# EAGLE design sensor_board (EAGLE 9.6.2)
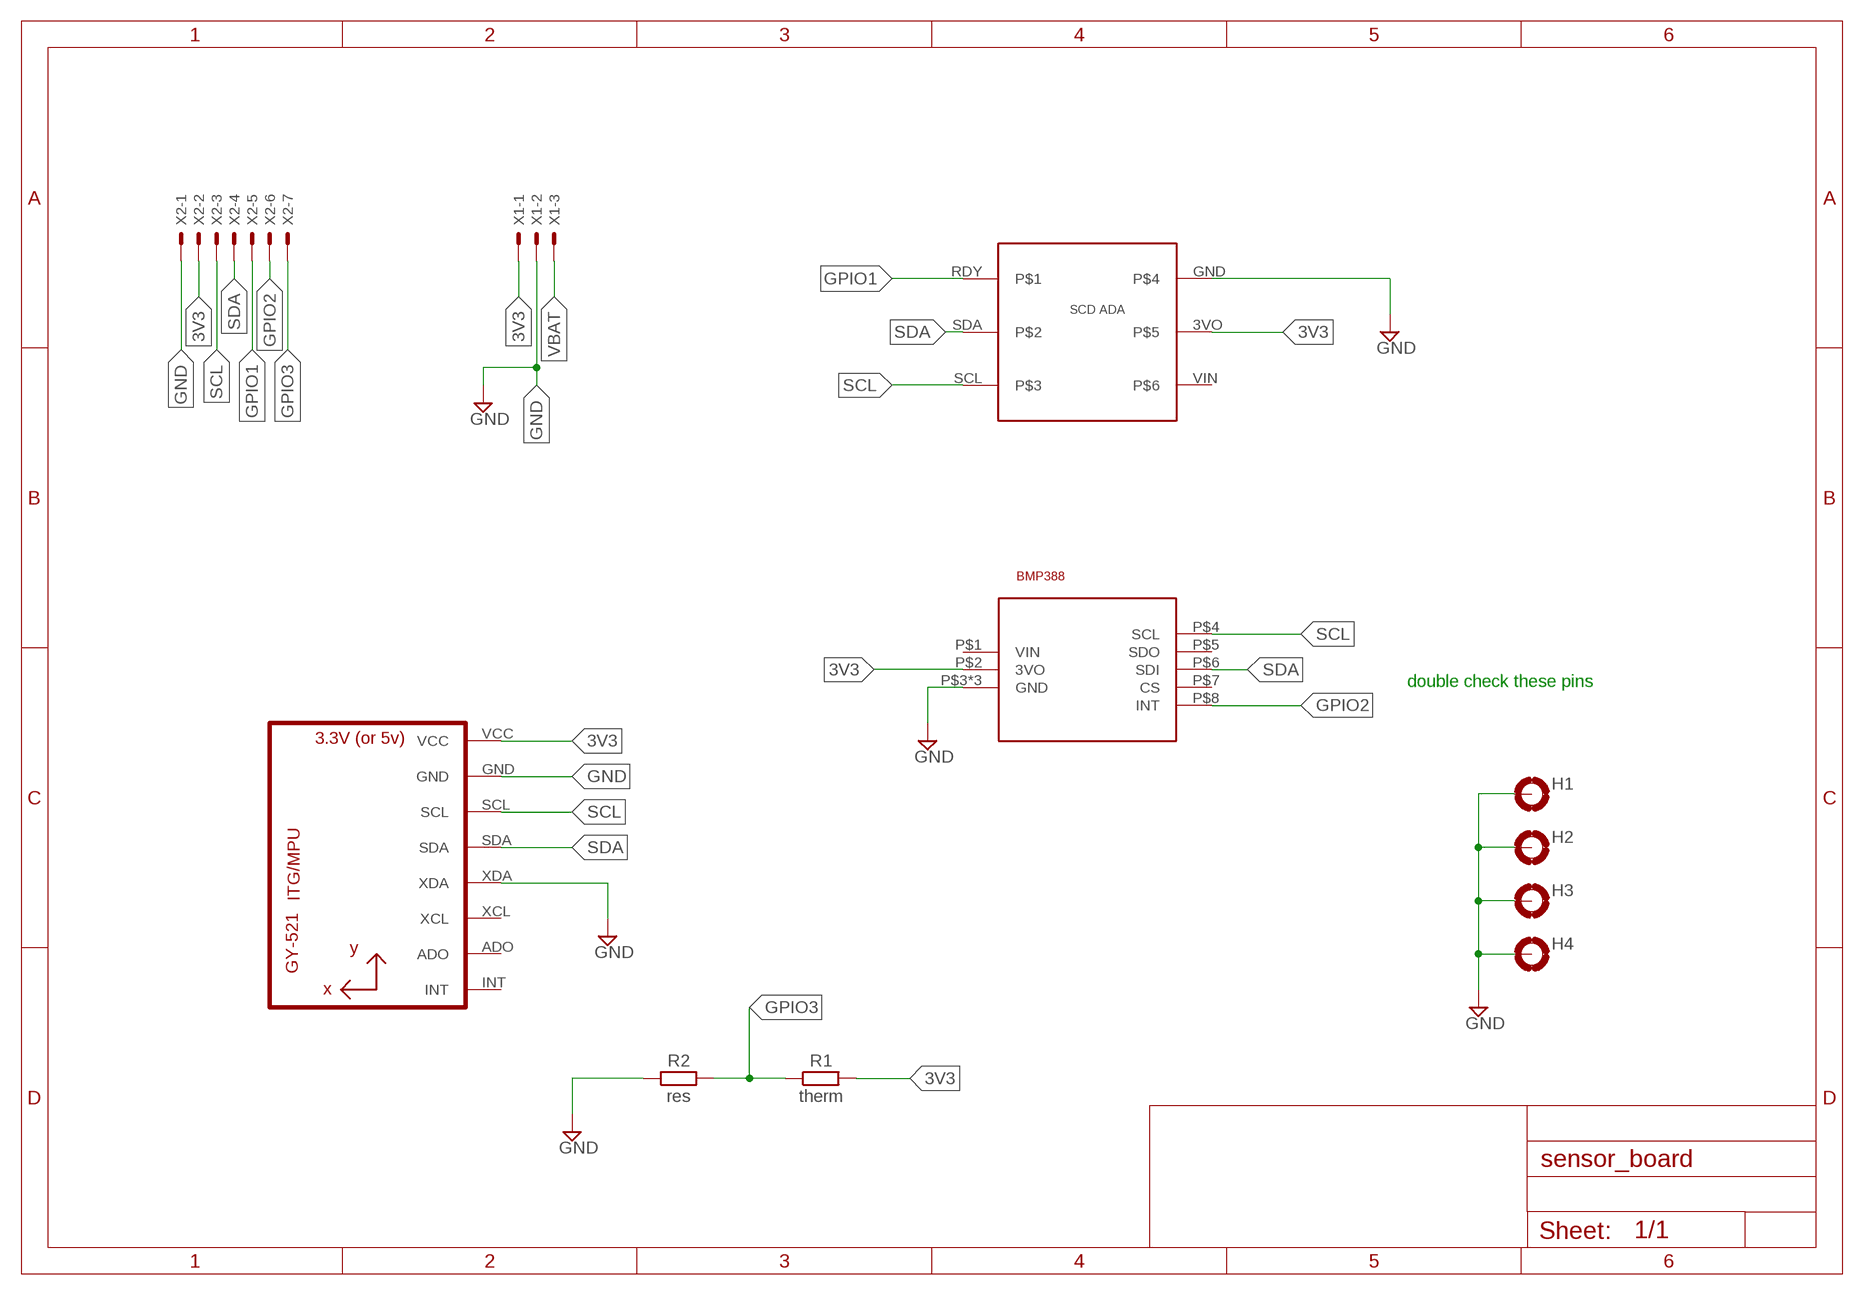
[diagram p0: schematic, sheet 1]

## Parts
H1  MOUNT-PAD-ROUND3.0  [3,0-PAD]
H2  MOUNT-PAD-ROUND3.0  [3,0-PAD]
H3  MOUNT-PAD-ROUND3.0  [3,0-PAD]
H4  MOUNT-PAD-ROUND3.0  [3,0-PAD]
R1  therm  R_AXIAL-11.7MM-PITCH  [RESAD1176W63L850D250B]
R2  res  R_AXIAL-11.7MM-PITCH  [RESAD1176W63L850D250B]
U1  GY-521MPU6050  [GY-521]
U$1  BMP388_QT  [BMP388_QT]
U$6  SCD30_ADA  [SCD30_ADA]
X1  JST-XH-03-PIN  [JST-XH_S3B]
X2  JST-XH-07-PIN  [JST-XH_S7B]

## Nets
3V3: R1.2 U1.VCC U$1.P$2(3VO) U$6.3VO X1.PIN1 X2.PIN2
GND: H1.B3,0(MOUNT) H2.B3,0(MOUNT) H3.B3,0(MOUNT) H4.B3,0(MOUNT) R2.1 U1.GND U1.XDA U$1.P$3(GND) U$1.P$9(GND) U$1.P$10(GND) U$6.GND X1.PIN2 X2.PIN1
GPIO1: U$6.RDY X2.PIN5
GPIO2: U$1.P$8(INT) X2.PIN6
GPIO3: R1.1 R2.2 X2.PIN7
SCL: U1.SCL U$1.P$4(SCL) U$6.SCL X2.PIN3
SDA: U1.SDA U$1.P$6(SDI) U$6.SDA X2.PIN4
VBAT: X1.PIN3
Unconnected: U1.ADO U1.INT U1.XCL U$1.P$1(VIN) U$1.P$5(SDO) U$1.P$7(CS) U$6.VIN

## Notes on the sheet
- double check these pins

## Library data of the parts
H1-H4 = holes:MOUNT-PAD-ROUND: MOUNTING PAD, round
R1 R2 = Resistor:R: Resistor Fixed - Generic; CATEGORY: Resistor; SUB-CATEGORY: Fixed
U1 = GY-521:GY-521: Check availability <https://pricing.snapeda.com/parts/GY-521/GODREAM%20FORDREAM%20CO.%2C%20LIMITED/view-part?ref=eda>; AVAILABILITY: Not in stock; CHECK_PRICES: https://www.snapeda.com/parts/GY-521/GODREAM+FORDREAM+CO.%252C+LIMITED/view-part/?ref=eda; DESCRIPTION: Triple Axis Accelerometer Gyro Breakout; MF: GODREAM FORDREAM CO., LIMITED; MP: GY-521; PACKAGE: Package; PRICE: None; SNAPEDA_LINK: https://www.snapeda.com/parts/GY-521/GODREAM+FORDREAM+CO.%252C+LIMITED/view-part/?ref=snap
U$1 = BMP388_QT:BMP388_QT
U$6 = SCD30:SCD30_ADA
X1 = JST-XH Connectors:JST-XH-03-PIN: JST XH Connector 2 Pin Wire to board connector. Pitch: 2,54 mm, (0.100") Number of pins: 3 Created by Rembrandt Electronics www.rembrandtelectronics.com
X2 = JST-XH Connectors:JST-XH-07-PIN: JST XH Connector 2 Pin Wire to board connector. Pitch: 2,54 mm, (0.100") Number of pins: 7 Created by Rembrandt Electronics www.rembrandtelectronics.com

## Board
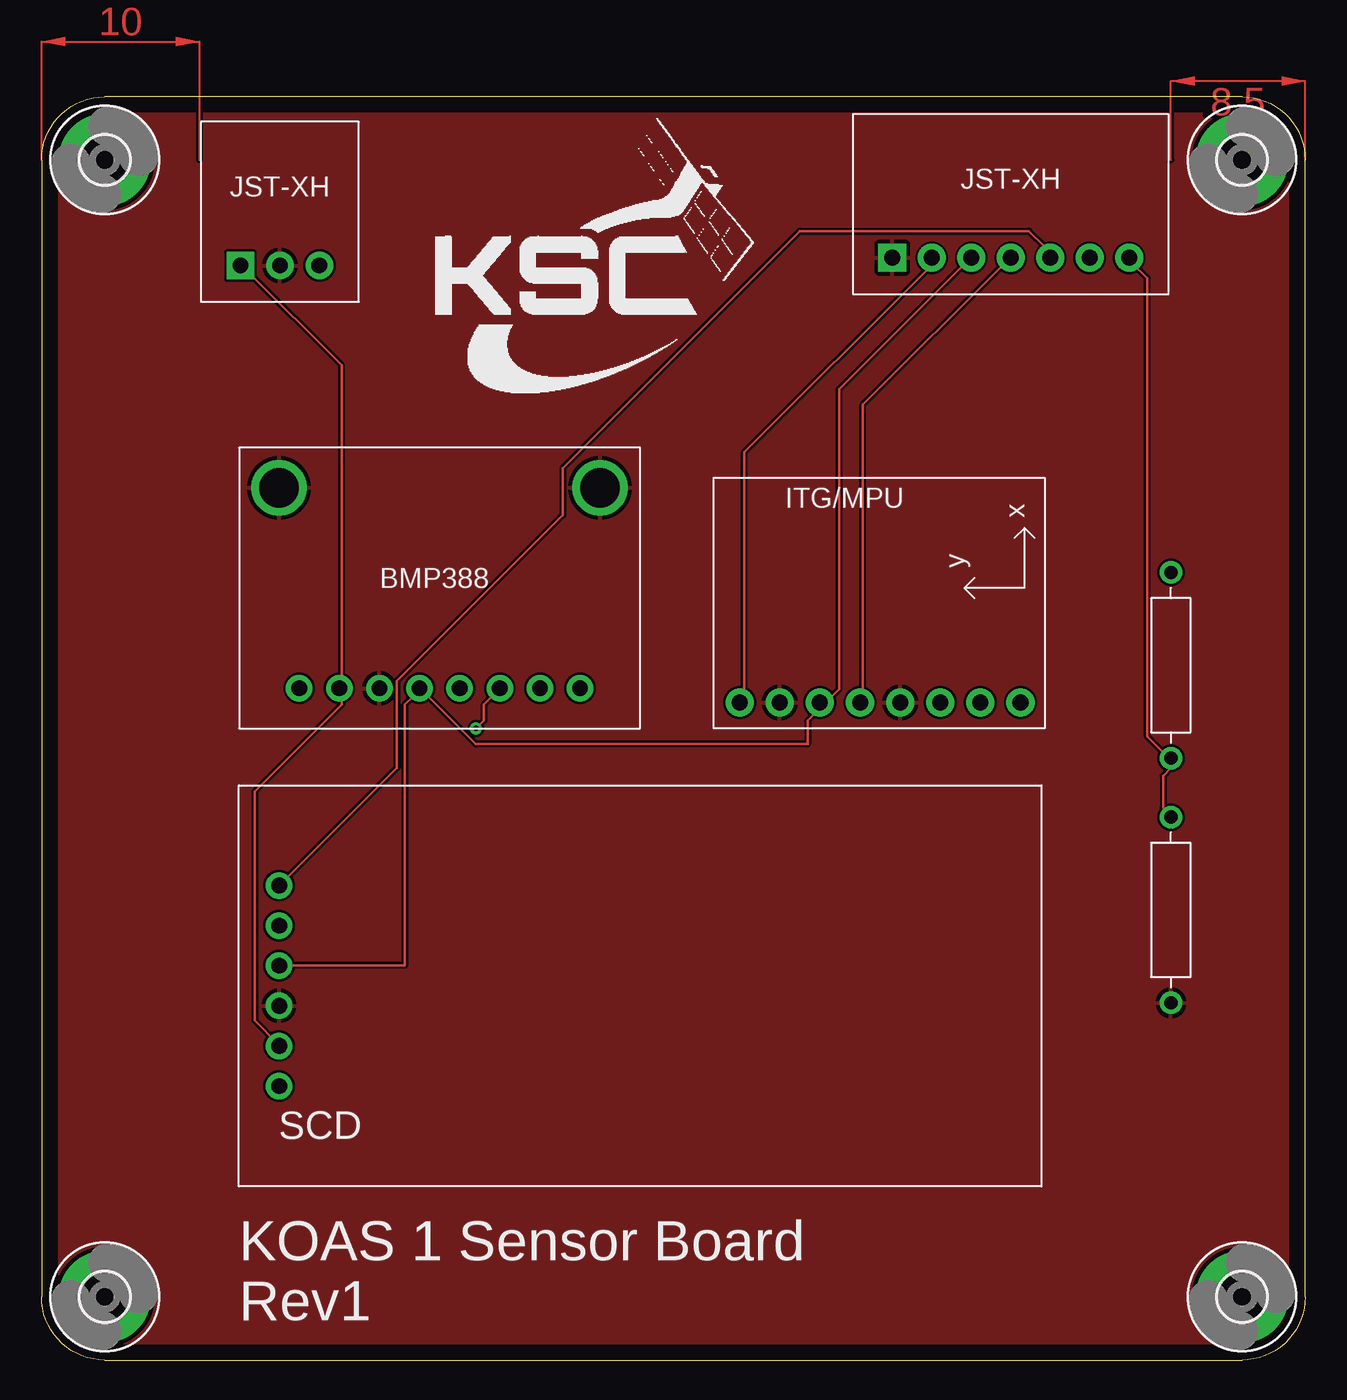
[diagram p1: board, top side]
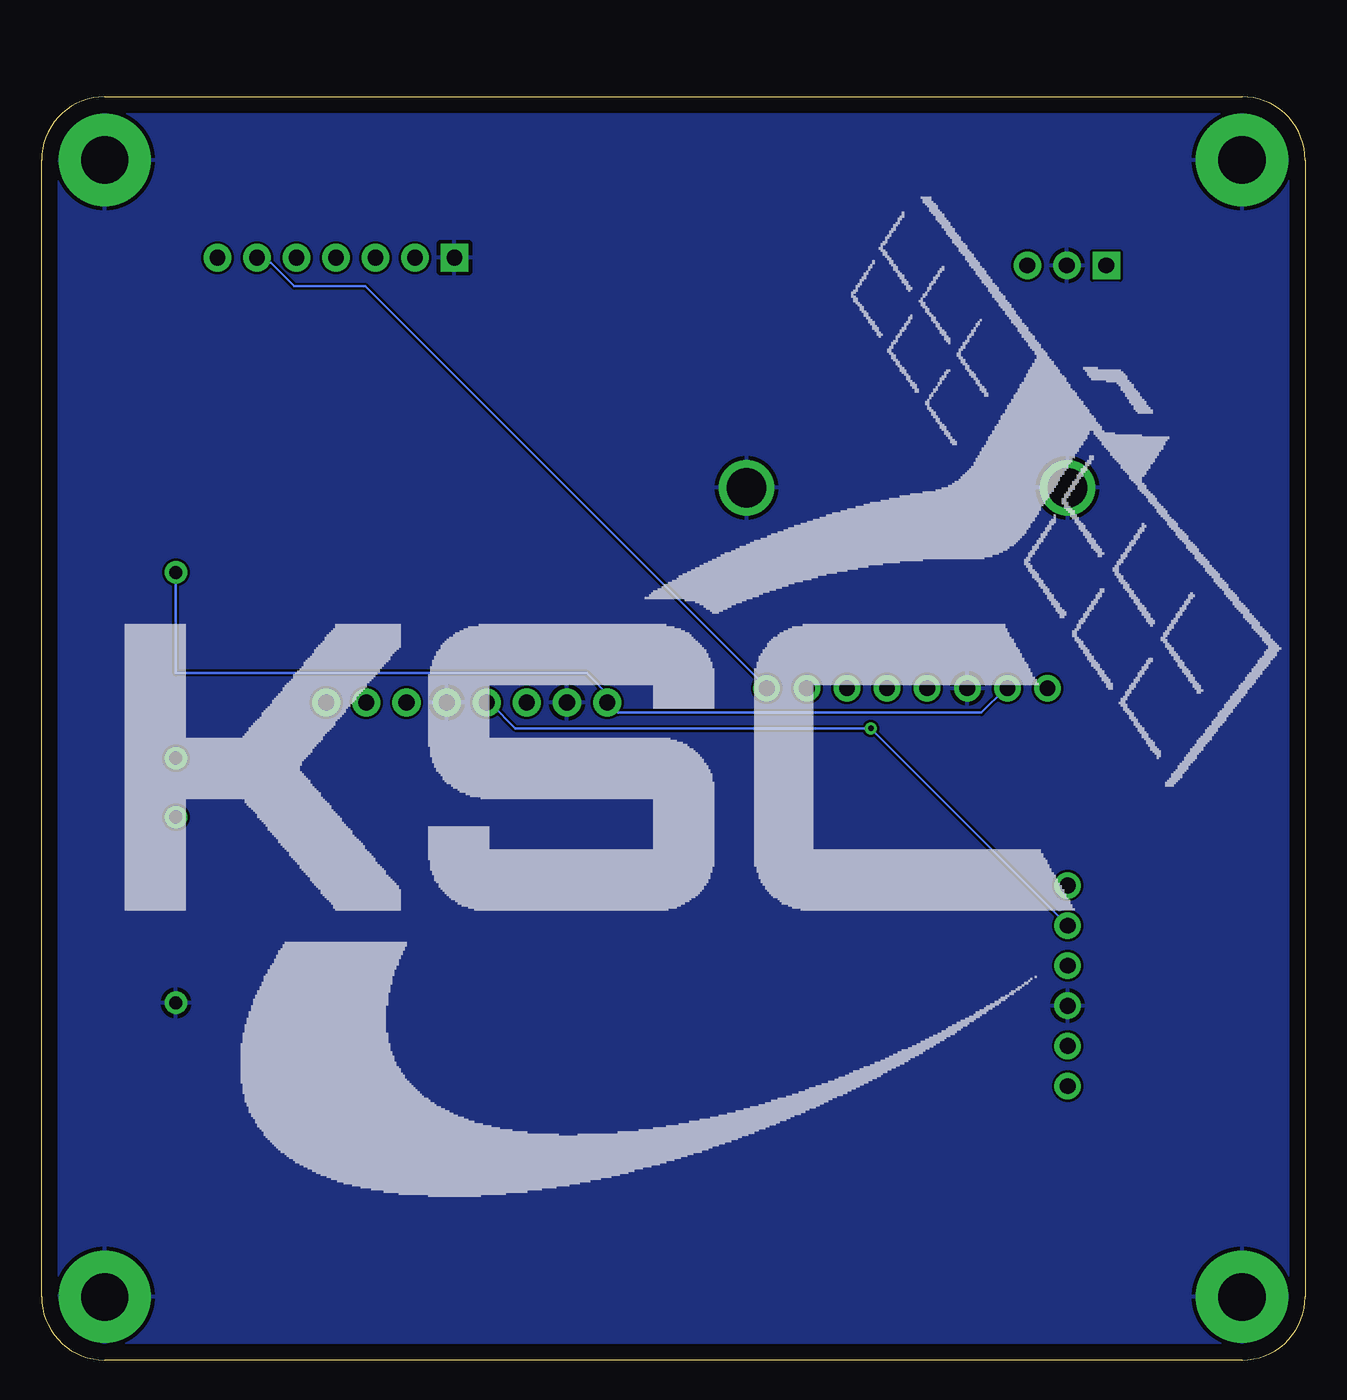
[diagram p2: board, bottom side, seen from below]

Size 80 x 80 mm. Coordinates in mm from the lower left corner, seen from the top.
Outline: 4,0 76,0 arc90 80,4 80,76 arc90 76,80 4,80 arc90 0,76 0,4 arc90 4,0
Copper layers (1*16): Top 0.035mm / dielectric 1.5mm / Bottom 0.035mm
Design rules "default": minimum track width 6mil, minimum drill 0.35mm, track to track 6mil, track to pad 6mil, pad to pad 6mil, via to via 6mil, smd to smd 6mil, copper to edge 40mil, drill to drill 6mil, minimum pad ring 10mil, minimum via ring 8mil, stop-mask expansion 4mil, vias tented up to drill 0mil, thermal gap 10mil

### Footprints (pad centres in the part's own frame; a part is rotated, then mirrored left to right if it is on the bottom)
3,0-PAD = drill 3 pad 5.842: B3,0 0,0
RESAD1176W63L850D250B = drill 0.83 pad 1.43: 1 -5.88,0; 2 5.88,0
GY-521 = drill 1.016 pad 1.778: ADO 1.651,4.064; GND 1.651,16.764; INT 1.651,1.524; SCL 1.651,14.224; SDA 1.651,11.684; VCC 1.651,19.304; XCL 1.651,6.604; XDA 1.651,9.144
BMP388_QT = drill 1 pad 1.676: P$1 3.81,2.54; P$2 6.35,2.54; P$3 8.89,2.54; P$4 11.43,2.54; P$5 13.97,2.54; P$6 16.51,2.54; P$7 19.05,2.54; P$8 21.59,2.54 | drill 2.5: P$9 2.54,15.24; P$10 22.86,15.24
SCD30_ADA = drill 1 pad 1.676: 3VO 2.54,8.89; GND 2.54,11.43; RDY 2.54,19.05; SCL 2.54,13.97; SDA 2.54,16.51; VIN 2.54,6.35
JST-XH_S3B = drill 1 pad 1.75 square: PIN1 0,0 | drill 1 pad 1.75: PIN2 2.5,0; PIN3 5,0
JST-XH_S7B = drill 1 pad 1.75 square: PIN1 0,0 | drill 1 pad 1.75: PIN2 2.5,0; PIN3 5,0; PIN4 7.5,0; PIN5 10,0; PIN6 12.5,0; PIN7 15,0

### Placement (x,y rotation side)
H1  4,4 0 top
H2  76,4 0 top
H3  4,76 0 top
H4  76,76 0 top
R1  71.5,44 90 top
R2  71.5,28.5 90 top
U1  63.5,40 90 top
U$1  12.5,40 0 top
U$6  12.5,11 0 top
X1  12.59,69.32 0 top
X2  53.86,69.81 0 top

### Tracks (layer width: path | path; a pad name or v marks a point on that pad's centre or on a via)
3V3
  Top 0.152: X2.PIN2 56,69.5 56,69 44.5,57.5 44.5,42 U1.VCC | U$6.3VO 15,20 13.5,21.5 13.5,36 19,41.5 19,42.5 U$1.P$2 19,43 19,63 13,69 X1.PIN1
  Bottom 0.152: R1.2 71.5,43.5 45.5,43.5 44,42 U1.VCC 44,41.5 43.5,41 20.5,41 19,42.5 U$1.P$2
GND
  pour Top: 0,0 0,80 80,80 80,0
  pour Bottom: 0,0 0,80 80,80 80,0
GPIO1
  Top 0.152: U$6.RDY 15.5,30.5 22.5,37.5 22.5,43 33,53.5 33,56.5 48,71.5 62.5,71.5 63.5,70.5 63.5,70 X2.PIN5
GPIO2
  Bottom 0.152: U$1.P$8 34.5,43 59.5,68 64,68 65.5,69.5 66,69.5 X2.PIN6
GPIO3
  Top 0.152: 71.5,38 71.5,37.5 71,37 71,35 71.5,34.5 R2.2 | 71.5,38 70,39.5 70,68.5 69,69.5 X2.PIN7 | 71.5,38 R1.1
SCL
  Top 0.152: U$6.SCL 15.5,25 23,25 23,41.5 23.5,42 23.5,42.5 U$1.P$4 24,42.5 27.5,39 48.5,39 48.5,40.5 49,41 49,41.5 U1.SCL 49.5,41.5 50.5,42.5 50.5,61.5 58.5,69.5 X2.PIN3
SDA  (via drill 0.35)
  Top 0.152: v27.5,40 28,40.5 28,41.5 29,42.5 U$1.P$6 | X2.PIN4 61,69.5 52,60.5 52,42 U1.SDA
  Bottom 0.152: U$6.SDA 15.5,28 v27.5,40 50,40 51.5,41.5 U1.SDA
(copper drawn outside any net)
  shapes: Top area x2

### Text on the board
tPlace: KOAS 1 Sensor Board / Rev1
tNames: SCD